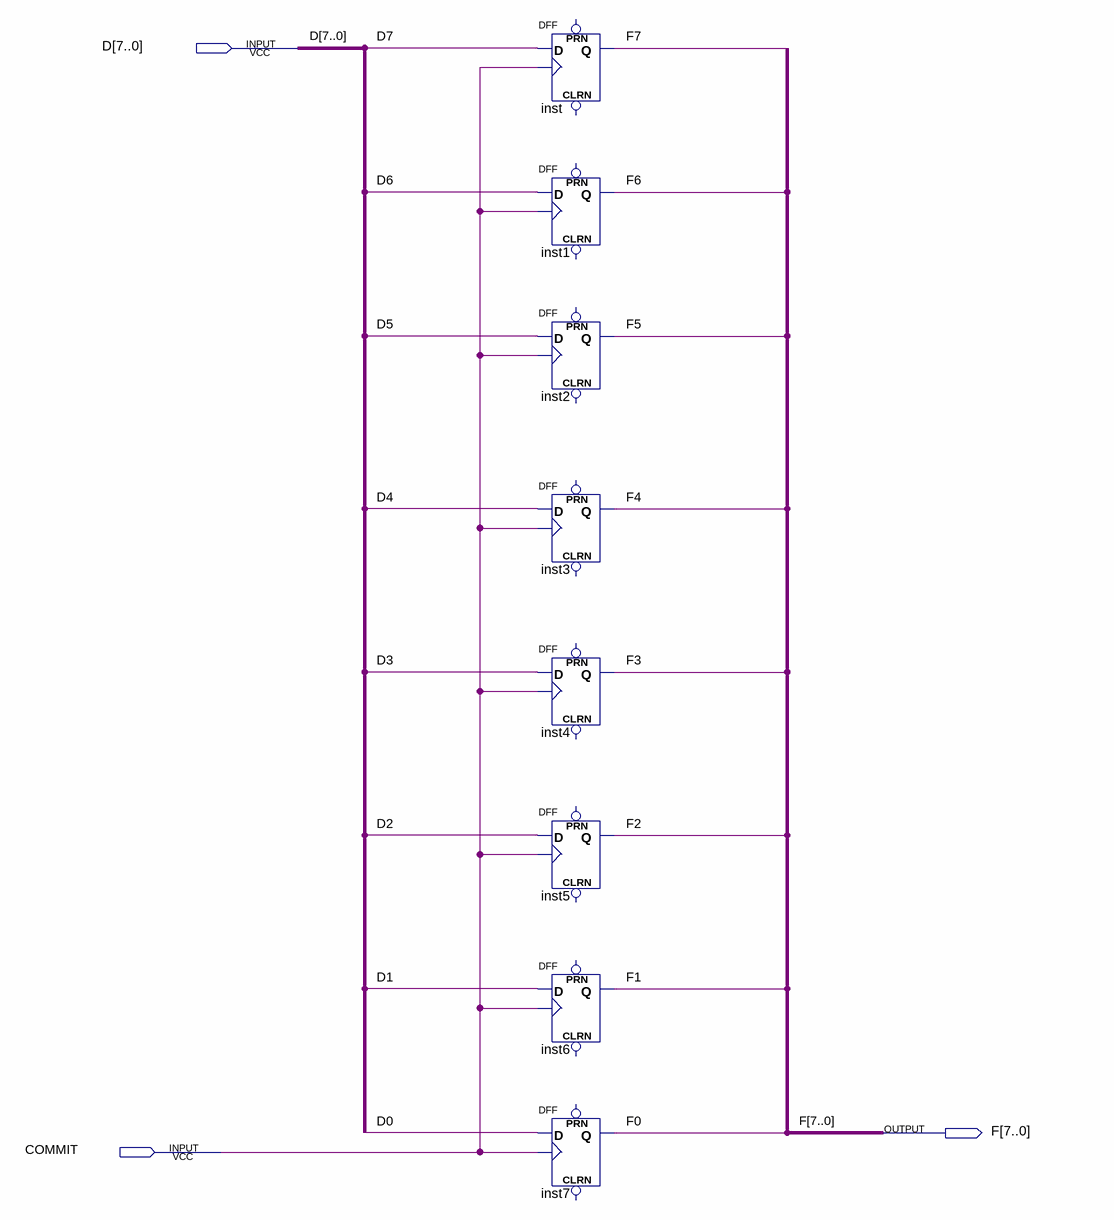
[diagram p0: schematic sheet]
// Quartus schematic dff_8b.bdf as structural Verilog: 8 symbols, 3 pins
module dff_8b (
  input  [7:0] D,
  input  COMMIT,
  output [7:0] F
);

  DFF inst (.CLK(COMMIT), .D(D[7]), .Q(F[7]));  // open: CLRN, PRN
  DFF inst1 (.CLK(COMMIT), .D(D[6]), .Q(F[6]));  // open: CLRN, PRN
  DFF inst2 (.CLK(COMMIT), .D(D[5]), .Q(F[5]));  // open: CLRN, PRN
  DFF inst3 (.CLK(COMMIT), .D(D[4]), .Q(F[4]));  // open: CLRN, PRN
  DFF inst4 (.CLK(COMMIT), .D(D[3]), .Q(F[3]));  // open: CLRN, PRN
  DFF inst5 (.CLK(COMMIT), .D(D[2]), .Q(F[2]));  // open: CLRN, PRN
  DFF inst6 (.CLK(COMMIT), .D(D[1]), .Q(F[1]));  // open: CLRN, PRN
  DFF inst7 (.CLK(COMMIT), .D(D[0]), .Q(F[0]));  // open: CLRN, PRN
endmodule
